# EAGLE design NixieClock (EAGLE 7.2.0)
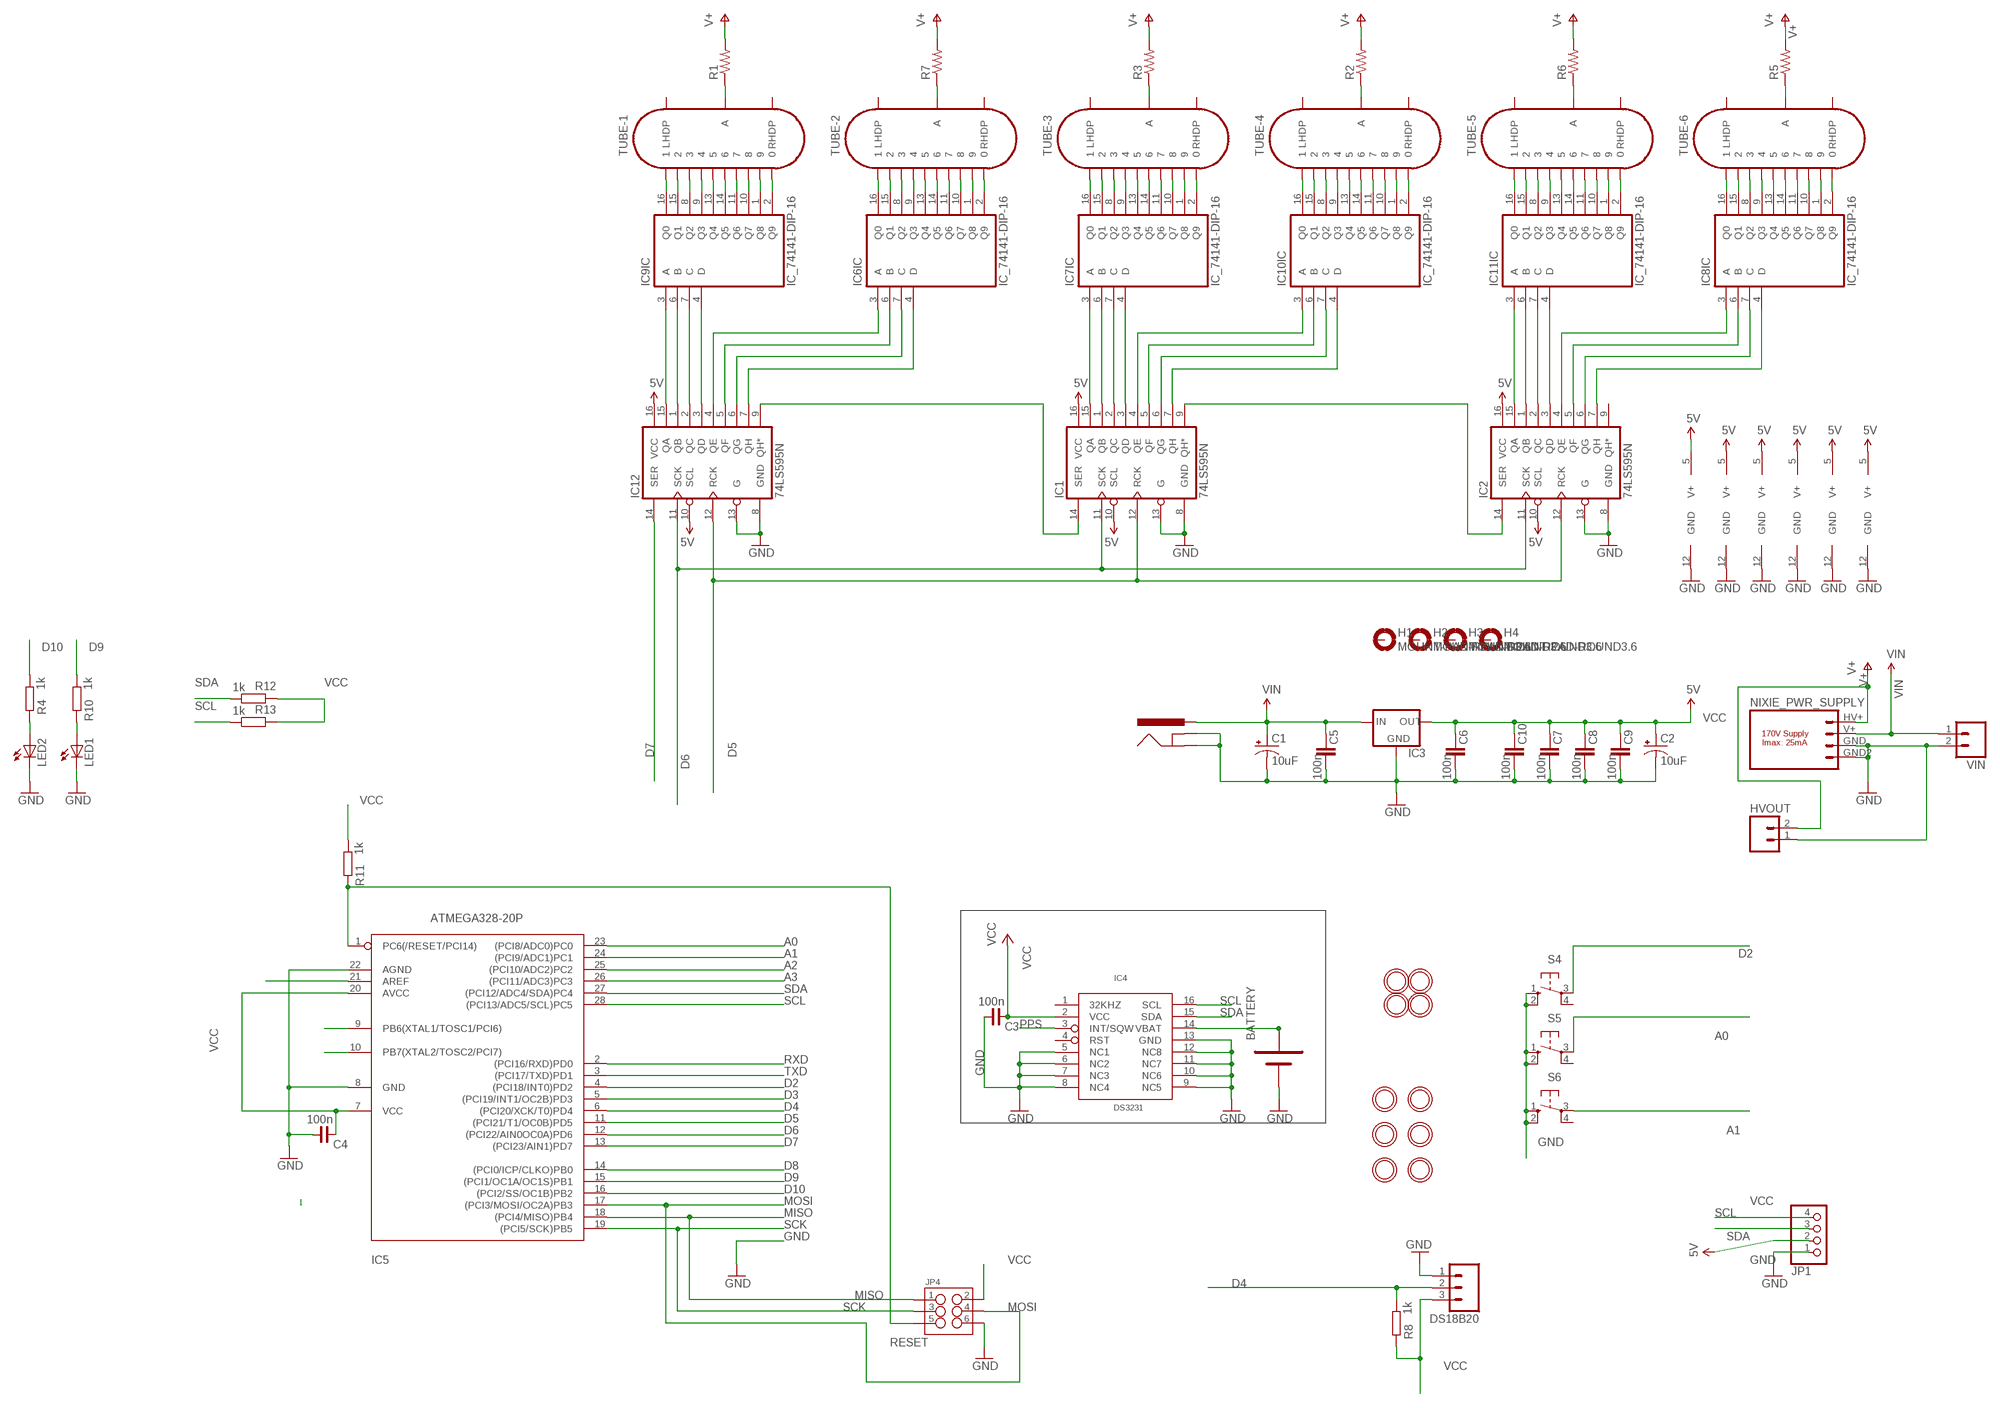
[diagram p0: schematic, sheet 1]

## Parts
BATTERY  BATTERY-1XAA20MM  [BATTCOM_20MM_PTH]
C1  10uF  CAP_POLPTH2  [CPOL-RADIAL-10UF-25V]
C2  10uF  CAP_POLPTH2  [CPOL-RADIAL-10UF-25V]
C3  100n  C_0603  [C0603]
C4  100n  C_0603  [C0603]
C5  100n  C-EU050-025X075  [C050-025X075]
C6  100n  C-EU050-025X075  [C050-025X075]
C7  100n  C-EU050-025X075  [C050-025X075]
C8  100n  C-EU050-025X075  [C050-025X075]
C9  100n  C-EU050-025X075  [C050-025X075]
C10  100n  C-EU050-025X075  [C050-025X075]
DS18B20  DS18B20DS18B20  [DS18B20]
H1  MOUNT-PAD-ROUND3.6  [3,6-PAD]
H2  MOUNT-PAD-ROUND3.6  [3,6-PAD]
H3  MOUNT-PAD-ROUND3.6  [3,6-PAD]
H4  MOUNT-PAD-ROUND3.6  [3,6-PAD]
HVOUT  M02PTH  [1X02]
IC1  74LS595N  [DIL16]
IC2  74LS595N  [DIL16]
IC3  V_REG_78XXSIDE  [78XXL]
IC4  DS3231  [SO16W]
IC5  ATMEGA328-20P  ATMEGA168-20P  [DIL28-3]
IC6  IC_74141-DIP-16  [DIL16]
IC7  IC_74141-DIP-16  [DIL16]
IC8  IC_74141-DIP-16  [DIL16]
IC9  IC_74141-DIP-16  [DIL16]
IC10  IC_74141-DIP-16  [DIL16]
IC11  IC_74141-DIP-16  [DIL16]
IC12  74LS595N  [DIL16]
J1  POWER_JACKPTH  [POWER_JACK_PTH]
JP1  PINHD-1X4  [1X04]
JP4  M03X2NO_SILK  [2X3-NS]
LED1  LED3MM  [LED3MM]
LED2  LED3MM  [LED3MM]
NIXIE_PWR_SUPPLY  NIXIE_PWR_SUPPLYPTH  [NIXIE_PWR_SUPPLY]
R1  RESISTORPTH-1/4W  [AXIAL-0.4]
R2  RESISTORPTH-1/4W  [AXIAL-0.4]
R3  RESISTORPTH-1/4W  [AXIAL-0.4]
R4  1k  R-EU_0204/5  [0204/5]
R5  RESISTORPTH-1/4W  [AXIAL-0.4]
R6  RESISTORPTH-1/4W  [AXIAL-0.4]
R7  RESISTORPTH-1/4W  [AXIAL-0.4]
R8  1k  R-EU_0204/5  [0204/5]
R10  1k  R-EU_0204/5  [0204/5]
R11  1k  R-EU_0204/5  [0204/5]
R12  1k  R-EU_0204/5  [0204/5]
R13  1k  R-EU_0204/5  [0204/5]
S4  10-XX  [B3F-10XX]
S5  10-XX  [B3F-10XX]
S6  10-XX  [B3F-10XX]
TUBE-1  IN-14  [IN-14]
TUBE-2  IN-14  [IN-14]
TUBE-3  IN-14  [IN-14]
TUBE-4  IN-14  [IN-14]
TUBE-5  IN-14  [IN-14]
TUBE-6  IN-14  [IN-14]
U$10  MOUNTINGHOLE3.0THIN  [MOUNTINGHOLE_3.0_PLATEDTHIN]
U$11  MOUNTINGHOLE3.0THIN  [MOUNTINGHOLE_3.0_PLATEDTHIN]
U$16  MOUNTINGHOLE3.0THIN  [MOUNTINGHOLE_3.0_PLATEDTHIN]
U$17  MOUNTINGHOLE3.0THIN  [MOUNTINGHOLE_3.0_PLATEDTHIN]
U$18  MOUNTINGHOLE3.0THIN  [MOUNTINGHOLE_3.0_PLATEDTHIN]
U$19  MOUNTINGHOLE3.0THIN  [MOUNTINGHOLE_3.0_PLATEDTHIN]
U$21  MOUNTINGHOLE3.0THIN  [MOUNTINGHOLE_3.0_PLATEDTHIN]
U$22  MOUNTINGHOLE3.0THIN  [MOUNTINGHOLE_3.0_PLATEDTHIN]
U$23  MOUNTINGHOLE3.0THIN  [MOUNTINGHOLE_3.0_PLATEDTHIN]
U$24  MOUNTINGHOLE3.0THIN  [MOUNTINGHOLE_3.0_PLATEDTHIN]
VIN  M02PTH  [1X02]

## Nets
A0: IC5.23((PCI8/ADC0)PC0) S5.3(P)
A1: IC5.24((PCI9/ADC1)PC1) S6.3(P)
A2: IC5.25((PCI10/ADC2)PC2)
A3: IC5.26((PCI11/ADC3)PC3)
AREF_RAW: IC5.21(AREF)
D2: IC5.4((PCI18/INT0)PD2) S4.3(P)
D3: IC5.5((PCI19/INT1/OC2B)PD3)
D4: DS18B20.2(DS) IC5.6((PCI20/XCK/T0)PD4) R8.1
D5: IC1.12(RCK) IC2.12(RCK) IC5.11((PCI21/T1/OC0B)PD5) IC12.12(RCK)
D6: IC1.11(SCK) IC2.11(SCK) IC5.12((PCI22/AIN0OC0A)PD6) IC12.11(SCK)
D7: IC5.13((PCI23/AIN1)PD7) IC12.14(SER)
D8: IC5.14((PCI0/ICP/CLKO)PB0)
D9: IC5.15((PCI1/OC1A/OC1S)PB1) R10.1
D10: IC5.16((PCI2/SS/OC1B)PB2) R4.1
GND: BATTERY.- C1.2(-) C2.2(-) C3.1 C4.1 C5.2 C6.2 C7.2 C8.2 C9.2 C10.2 DS18B20.1(GND) HVOUT.1 IC1.8(GND) IC1.13(G) IC2.8(GND) IC2.13(G) IC3.GND IC4.5(NC1) IC4.6(NC2) IC4.7(NC3) IC4.8(NC4) IC4.9(NC5) IC4.10(NC6) IC4.11(NC7) IC4.12(NC8) IC4.13(GND) IC5.8(GND) IC5.22(AGND) IC6.12(SUPPLY:GND) IC7.12(SUPPLY:GND) IC8.12(SUPPLY:GND) IC9.12(SUPPLY:GND) IC10.12(SUPPLY:GND) IC11.12(SUPPLY:GND) IC12.8(GND) IC12.13(G) J1.GND J1.GNDBREAK JP1.1 JP4.6 LED1.K(C) LED2.K(C) NIXIE_PWR_SUPPLY.GND NIXIE_PWR_SUPPLY.GND2 S4.1(S) S4.2(S1) S5.1(S) S5.2(S1) S6.1(S) S6.2(S1) VIN.2
MISO: IC5.18((PCI4/MISO)PB4) JP4.1
MOSI: IC5.17((PCI3/MOSI/OC2A)PB3) JP4.4
N$1 [High Voltage 170V]: R1.P$1 TUBE-1.A
N$2 [High Voltage 170V]: R7.P$1 TUBE-2.A
N$3 [High Voltage 170V]: R3.P$1 TUBE-3.A
N$4 [High Voltage 170V]: R2.P$1 TUBE-4.A
N$5 [High Voltage 170V]: R6.P$1 TUBE-5.A
N$6 [High Voltage 170V]: R5.P$1 TUBE-6.A
N$7: IC9.16(IC:Q0) TUBE-1.1
N$8 [High Voltage 60V]: IC9.15(IC:Q1) TUBE-1.2
N$9 [High Voltage 60V]: IC9.8(IC:Q2) TUBE-1.3
N$10 [High Voltage 60V]: IC9.9(IC:Q3) TUBE-1.4
N$11 [High Voltage 60V]: IC9.13(IC:Q4) TUBE-1.5
N$12 [High Voltage 60V]: IC9.14(IC:Q5) TUBE-1.6
N$13 [High Voltage 60V]: IC9.11(IC:Q6) TUBE-1.7
N$14 [High Voltage 60V]: IC9.10(IC:Q7) TUBE-1.8
N$15 [High Voltage 60V]: IC9.1(IC:Q8) TUBE-1.9
N$16 [High Voltage 60V]: IC9.2(IC:Q9) TUBE-1.0
N$17 [High Voltage 60V]: IC6.16(IC:Q0) TUBE-2.1
N$18 [High Voltage 60V]: IC6.15(IC:Q1) TUBE-2.2
N$19 [High Voltage 60V]: IC6.8(IC:Q2) TUBE-2.3
N$20 [High Voltage 60V]: IC6.9(IC:Q3) TUBE-2.4
N$21 [High Voltage 60V]: IC6.13(IC:Q4) TUBE-2.5
N$22 [High Voltage 60V]: IC6.14(IC:Q5) TUBE-2.6
N$23 [High Voltage 60V]: IC6.11(IC:Q6) TUBE-2.7
N$24 [High Voltage 60V]: IC6.10(IC:Q7) TUBE-2.8
N$25 [High Voltage 60V]: IC6.1(IC:Q8) TUBE-2.9
N$26 [High Voltage 60V]: IC6.2(IC:Q9) TUBE-2.0
N$27 [High Voltage 60V]: IC7.16(IC:Q0) TUBE-3.1
N$28 [High Voltage 60V]: IC7.15(IC:Q1) TUBE-3.2
N$29 [High Voltage 60V]: IC7.8(IC:Q2) TUBE-3.3
N$30 [High Voltage 60V]: IC7.9(IC:Q3) TUBE-3.4
N$31 [High Voltage 60V]: IC7.13(IC:Q4) TUBE-3.5
N$32 [High Voltage 60V]: IC7.14(IC:Q5) TUBE-3.6
N$33 [High Voltage 60V]: IC7.11(IC:Q6) TUBE-3.7
N$34 [High Voltage 60V]: IC7.10(IC:Q7) TUBE-3.8
N$35 [High Voltage 60V]: IC7.1(IC:Q8) TUBE-3.9
N$36 [High Voltage 60V]: IC7.2(IC:Q9) TUBE-3.0
N$37 [High Voltage 60V]: IC10.16(IC:Q0) TUBE-4.1
N$38 [High Voltage 60V]: IC10.15(IC:Q1) TUBE-4.2
N$39 [High Voltage 60V]: IC10.8(IC:Q2) TUBE-4.3
N$40 [High Voltage 60V]: IC10.9(IC:Q3) TUBE-4.4
N$41 [High Voltage 60V]: IC10.13(IC:Q4) TUBE-4.5
N$42 [High Voltage 60V]: IC10.14(IC:Q5) TUBE-4.6
N$43 [High Voltage 60V]: IC10.11(IC:Q6) TUBE-4.7
N$44 [High Voltage 60V]: IC10.10(IC:Q7) TUBE-4.8
N$45 [High Voltage 60V]: IC10.1(IC:Q8) TUBE-4.9
N$46 [High Voltage 60V]: IC10.2(IC:Q9) TUBE-4.0
N$47 [High Voltage 60V]: IC11.16(IC:Q0) TUBE-5.1
N$48 [High Voltage 60V]: IC11.15(IC:Q1) TUBE-5.2
N$49 [High Voltage 60V]: IC11.8(IC:Q2) TUBE-5.3
N$50 [High Voltage 60V]: IC11.9(IC:Q3) TUBE-5.4
N$51 [High Voltage 60V]: IC11.13(IC:Q4) TUBE-5.5
N$52 [High Voltage 60V]: IC11.14(IC:Q5) TUBE-5.6
N$53 [High Voltage 60V]: IC11.11(IC:Q6) TUBE-5.7
N$54 [High Voltage 60V]: IC11.10(IC:Q7) TUBE-5.8
N$55 [High Voltage 60V]: IC11.1(IC:Q8) TUBE-5.9
N$56 [High Voltage 60V]: IC11.2(IC:Q9) TUBE-5.0
N$57 [High Voltage 60V]: IC8.16(IC:Q0) TUBE-6.1
N$58 [High Voltage 60V]: IC8.15(IC:Q1) TUBE-6.2
N$59 [High Voltage 60V]: IC8.8(IC:Q2) TUBE-6.3
N$60 [High Voltage 60V]: IC8.9(IC:Q3) TUBE-6.4
N$61 [High Voltage 60V]: IC8.13(IC:Q4) TUBE-6.5
N$62 [High Voltage 60V]: IC8.14(IC:Q5) TUBE-6.6
N$63 [High Voltage 60V]: IC8.11(IC:Q6) TUBE-6.7
N$64 [High Voltage 60V]: IC8.10(IC:Q7) TUBE-6.8
N$65 [High Voltage 60V]: IC8.1(IC:Q8) TUBE-6.9
N$66 [High Voltage 60V]: IC8.2(IC:Q9) TUBE-6.0
N$67: IC1.1(QB) IC7.6(IC:B)
N$68: IC1.2(QC) IC7.7(IC:C)
N$69: IC1.3(QD) IC7.4(IC:D)
N$70: IC1.15(QA) IC7.3(IC:A)
N$71: IC9.6(IC:B) IC12.1(QB)
N$72: IC9.7(IC:C) IC12.2(QC)
N$73: IC9.4(IC:D) IC12.3(QD)
N$74: IC9.3(IC:A) IC12.15(QA)
N$75: IC2.1(QB) IC11.6(IC:B)
N$76: IC2.2(QC) IC11.7(IC:C)
N$77: IC2.3(QD) IC11.4(IC:D)
N$78: IC2.15(QA) IC11.3(IC:A)
N$79: IC6.3(IC:A) IC12.4(QE)
N$80: IC6.6(IC:B) IC12.5(QF)
N$81: IC6.7(IC:C) IC12.6(QG)
N$82: IC6.4(IC:D) IC12.7(QH)
N$83: IC1.14(SER) IC12.9(QH*)
N$84: IC1.9(QH*) IC2.14(SER)
N$85: IC1.4(QE) IC10.3(IC:A)
N$86: IC1.5(QF) IC10.6(IC:B)
N$87: IC1.6(QG) IC10.7(IC:C)
N$88: IC1.7(QH) IC10.4(IC:D)
N$89: LED2.A R4.2
N$90: IC2.4(QE) IC8.3(IC:A)
N$91: IC2.5(QF) IC8.6(IC:B)
N$92: IC2.6(QG) IC8.7(IC:C)
N$93: IC2.7(QH) IC8.4(IC:D)
N$102: BATTERY.+ IC4.14(VBAT)
N$103: LED1.A R10.2
N$104: IC5.9(PB6(XTAL1/TOSC1/PCI6))
N$105: IC5.10(PB7(XTAL2/TOSC2/PCI7))
PPS: IC4.3(INT/SQW)
RESET: IC5.1(PC6(/RESET/PCI14)) JP4.5 R11.2
RXD: IC5.2((PCI16/RXD)PD0)
SCK: IC5.19((PCI5/SCK)PB5) JP4.3
SCL: IC4.16(SCL) IC5.28((PCI13/ADC5/SCL)PC5) JP1.4 R13.1
SDA: IC4.15(SDA) IC5.27((PCI12/ADC4/SDA)PC4) JP1.3 R12.1
TXD: IC5.3((PCI17/TXD)PD1)
V+ [High Voltage 170V]: HVOUT.2 NIXIE_PWR_SUPPLY.HV+ R1.P$2 R2.P$2 R3.P$2 R5.P$2 R6.P$2 R7.P$2
VCC [High Voltage 170V]: C2.1(+) C3.2 C4.2 C6.1 C7.1 C8.1 C9.1 C10.1 DS18B20.3(5V) IC1.10(SCL) IC1.16(VCC) IC2.10(SCL) IC2.16(VCC) IC3.OUT IC4.2(VCC) IC5.7(VCC) IC5.20(AVCC) IC6.5(SUPPLY:V+) IC7.5(SUPPLY:V+) IC8.5(SUPPLY:V+) IC9.5(SUPPLY:V+) IC10.5(SUPPLY:V+) IC11.5(SUPPLY:V+) IC12.10(SCL) IC12.16(VCC) JP1.2 JP4.2 R8.2 R11.1 R12.2 R13.2 ; supply symbol labelled 5V
VIN: C1.1(+) C5.1 IC3.IN J1.PWR NIXIE_PWR_SUPPLY.V+ VIN.1
Unconnected: H1.B3,6(MOUNT) H2.B3,6(MOUNT) H3.B3,6(MOUNT) H4.B3,6(MOUNT) IC2.9(QH*) IC4.1(32KHZ) IC4.4(RST) S4.4(P1) S5.4(P1) S6.4(P1) TUBE-1.LHDP TUBE-1.RHDP TUBE-2.LHDP TUBE-2.RHDP TUBE-3.LHDP TUBE-3.RHDP TUBE-4.LHDP TUBE-4.RHDP TUBE-5.LHDP TUBE-5.RHDP TUBE-6.LHDP TUBE-6.RHDP

## Library data of the parts
BATTERY = es:BATTERY-1XAA
C1 C2 = SparkFun-Passives:CAP_POL: Capacitor Polarized These are standard SMD and PTH capacitors. Normally 10uF, 47uF, and 100uF in electrolytic and tantalum varieties. Always verify the external diameter of the through hole cap, it varies with capacity, voltage, and manufacturer. The EIA devices should be standard.
C3 C4 = rc-master-smd:C_: NON-POLARIZED CAP
C5-C10 = rcl:C-EU: CAPACITOR, European symbol
DS18B20 = ScottCustom:DS18B20: Header 3 Standard 3-pin 0.1" header. Use with straight break away headers (SKU : PRT-00116), right angle break away headers (PRT-00553), swiss pins (PRT-00743), machine pins (PRT-00117), and female headers (PRT-00115). Molex polarized connector foot print use with SKU : PRT-08232 with associated crimp pins and housings.
H1-H4 = holes:MOUNT-PAD-ROUND: MOUNTING PAD, round
HVOUT VIN = SparkFun:M02: Header 2 Standard 2-pin 0.1" header. Use with straight break away headers (SKU : PRT-00116), right angle break away headers (PRT-00553), swiss pins (PRT-00743), machine pins (PRT-00117), and female headers (PRT-00115). Molex polarized connector foot print use with SKU : PRT-08233 with associated crimp pins and housings.
IC1 IC2 IC12 = SparkFun:74*595: 8-bit SHIFT REGISTER, output latch
IC3 = SparkFun:V_REG_78XX: Voltage Regulator Standard 7805 5V regulator. IGO (Input Ground Output). Spark Fun Electronics SKU : COM-00107
IC4 = JVN:DS3231
IC5 = avr:ATMEGA168*P: MICROCONTROLLER 16 kBytes FLASH 1 kBytes SRAM 512 Bytes EEPROM USART 8-channel 10 bit ADC
IC6-IC11 = dp_devices:IC_74141: BCD to decimal decoder
J1 = SparkFun:POWER_JACK: Power Jack This is the standard 5.5mm barrel jack for power. The PTH is the most common, proven, reliable, footprint. All others are experimental. The Slot footprint only works if the mill layer is transmitted to the PCB fab house so be warned. Spark Fun Electronics SKU : PRT-00119. Mating wall wart : TOL-00298 (and others)
JP1 = pinhead:PINHD-1X4: PIN HEADER
JP4 = SparkFun-Connectors:M03X2: 2x3 .1" header. Shrouded, with keying- CONN-10681 SMT- CONN-11415 Pogo pins- HW-11044
LED1 LED2 = led:LED: LED OSRAM: - CHIPLED LG R971, LG N971, LY N971, LG Q971, LY Q971, LO R971, LY R971 LH N974, LH R974 LS Q976, LO Q976, LY Q976 LO Q996 - Hyper CHIPLED LW Q18S LB Q993, LB Q99A, LB R99A - SideLED LS A670, LO A670, LY A670, LG A670, LP A670 LB A673, LV A673, LT A673, LW A673 LH A674 LY A675 LS A676, LA A676, LO A676, LY A676, LW A676 LS A679, LY A679, LG A679 - Hyper Micro SIDELED® LS Y876, LA Y876, LO Y876, LY Y876 LT Y87S - SmartLED LW L88C, LW L88S LB L89C, LB L89S, LG L890 LS L89K, LO L89K, LY L89K LS L896, LA L896, LO L896, LY L896 - TOPLED LS T670, LO T670, LY T670, LG T670, LP T670 LSG T670, LSP T670, LSY T670, LOP T670, LYG T670 LG T671, LOG T671, LSG T671 LB T673, LV T673, LT T673, LW T673 LH T674 LS T676, LA T676, LO T676, LY T676, LB T676, LH T676, LSB T676, LW T676 LB T67C, LV T67C, LT T67C, LS T67K, LO T67K, LY T67K, LW E67C LS E67B, LA E67B, LO E67B, LY E67B, LB E67C, LV E67C, LT E67C LW T67C LS T679, LY T679, LG T679 LS T770, LO T770, LY T770, LG T770, LP T770 LB T773, LV T773, LT T773, LW T773 LH T774 LS E675, LA E675, LY E675, LS T675 LS T776, LA T776, LO T776, LY T776, LB T776 LHGB T686 LT T68C, LB T68C - Hyper Mini TOPLED® LB M676 - Mini TOPLED Santana® LG M470 LS M47K, LO M47K, LY M47K Source: http://www.osram.convergy.de LUXEON: - LUMILED® LXK2-PW12-R00, LXK2-PW12-S00, LXK2-PW14-U00, LXK2-PW14-V00 LXK2-PM12-R00, LXK2-PM12-S00, LXK2-PM14-U00 LXK2-PE12-Q00, LXK2-PE12-R00, LXK2-PE12-S00, LXK2-PE14-T00, LXK2-PE14-U00 LXK2-PB12-K00, LXK2-PB12-L00, LXK2-PB12-M00, LXK2-PB14-N00, LXK2-PB14-P00, LXK2-PB14-Q00 LXK2-PR12-L00, LXK2-PR12-M00, LXK2-PR14-Q00, LXK2-PR14-R00 LXK2-PD12-Q00, LXK2-PD12-R00, LXK2-PD12-S00 LXK2-PH12-R00, LXK2-PH12-S00 LXK2-PL12-P00, LXK2-PL12-Q00, LXK2-PL12-R00 Source: www.luxeon.com KINGBRIGHT: KA-3528ASYC Source: www.kingbright.com
NIXIE_PWR_SUPPLY = ScottCustom:NIXIE_PWR_SUPPLY: Header 4 Standard 4-pin 0.1" header. Use with straight break away headers (SKU : PRT-00116), right angle break away headers (PRT-00553), swiss pins (PRT-00743), machine pins (PRT-00117), and female headers (PRT-00115). Molex polarized connector foot print use with SKU : PRT-08231 with associated crimp pins and housings. 1MM SMD Version SKU: PRT-10208
R1-R3 R5-R7 = SparkFun:RESISTOR: Resistor Basic schematic elements and footprints for 0603, 1206, and PTH resistors.
R4 R8 R10-R13 = rcl:R-EU_: RESISTOR, European symbol
S4-S6 = switch-omron:10-XX: OMRON SWITCH; MPN: B3F-1000; OC_FARNELL: 176432; OC_NEWARK: 36M3542
TUBE-1-TUBE-6 = ScottCustom:IN-14: IN-14: medium numeric frontview nixie tube
U$10 U$11 U$16-U$19 U$21-U$24 = microbuilder:MOUNTINGHOLE: Mounting Hole

## Net classes
0 default: width 0.305 mm, clearance 0.305 mm
1 High Voltage 170V: width 0.61 mm, clearance 0.61 mm
2 High Voltage 60V: width 0.406 mm, clearance 0.406 mm
3 Power GND: width 1.016 mm, clearance 0.406 mm

## Board
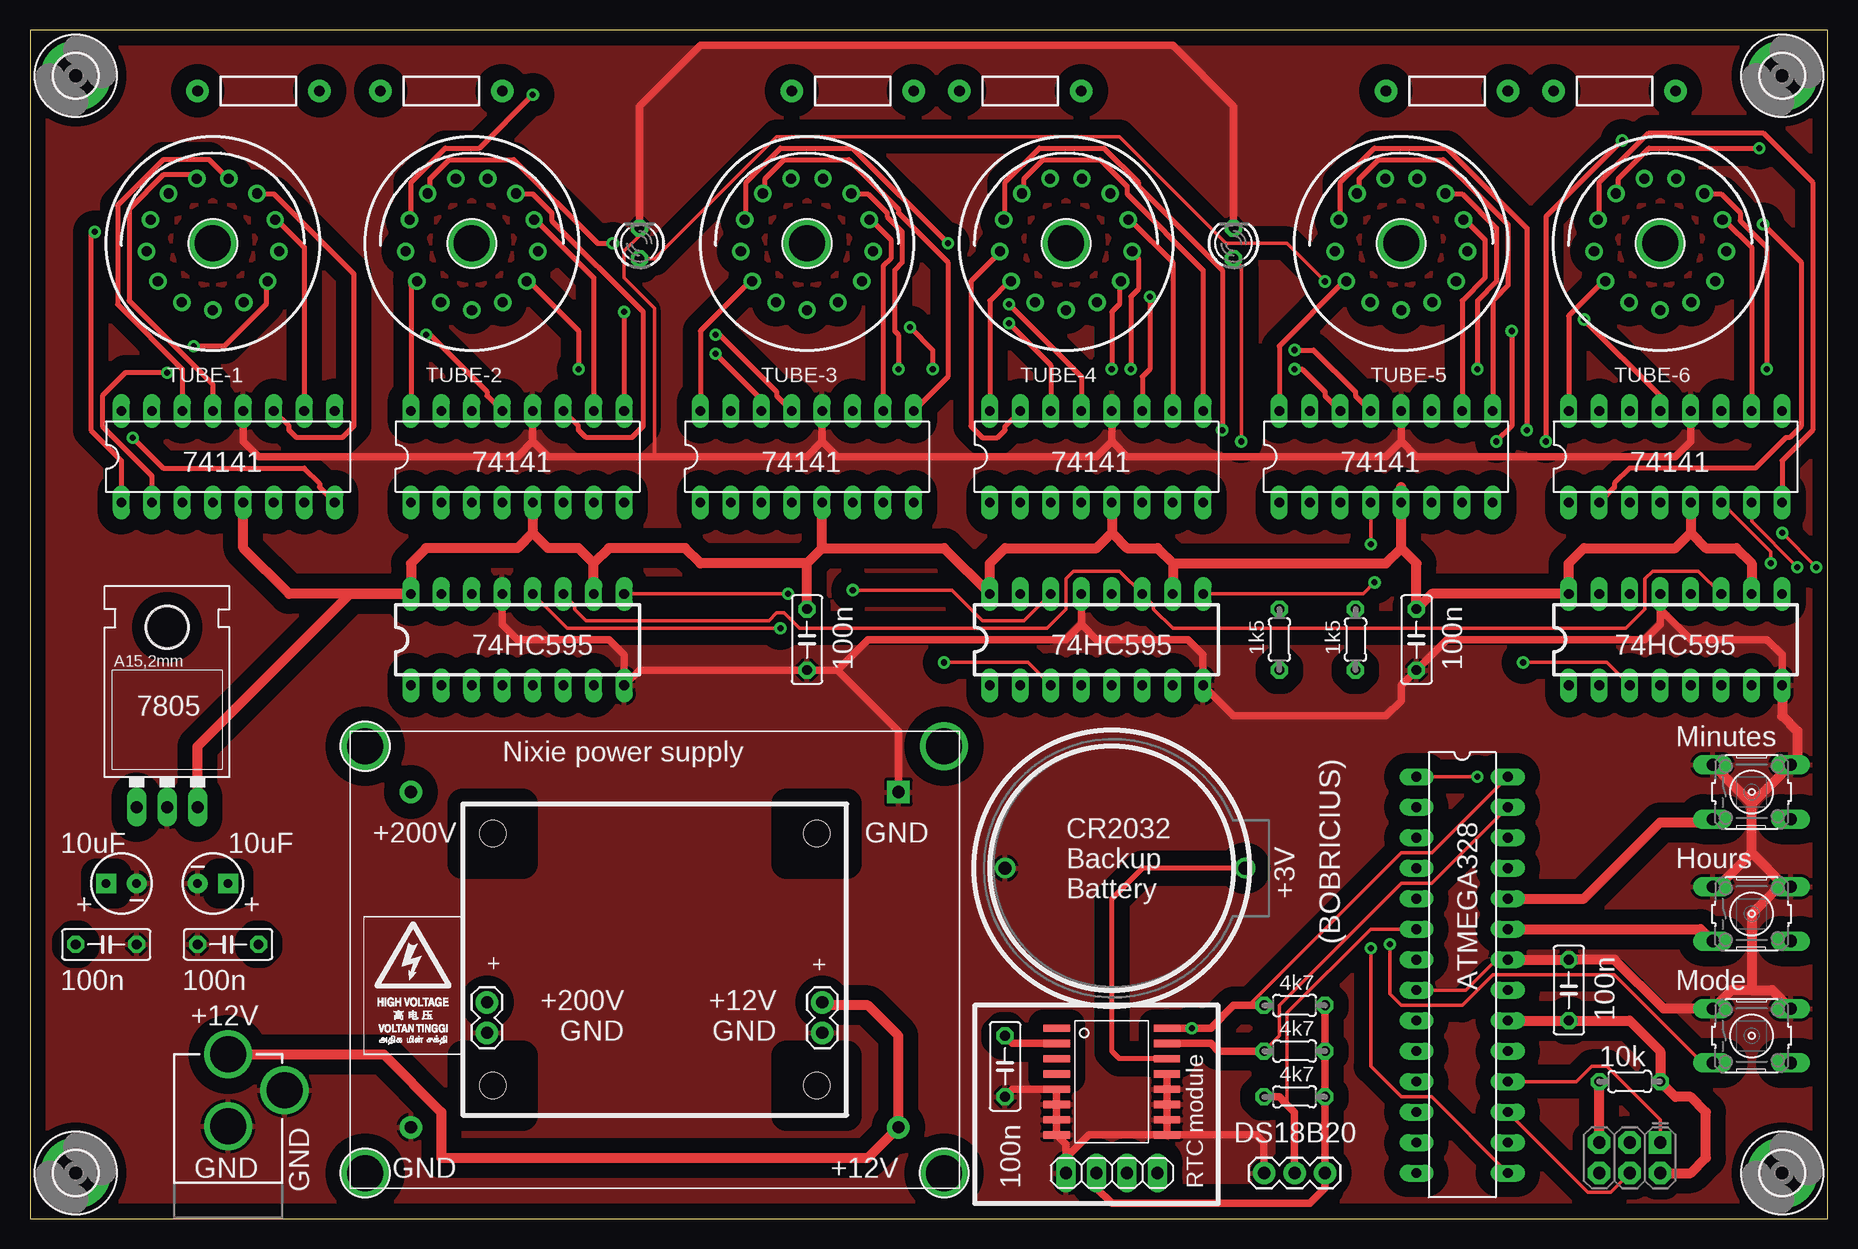
[diagram p1: board, top side]
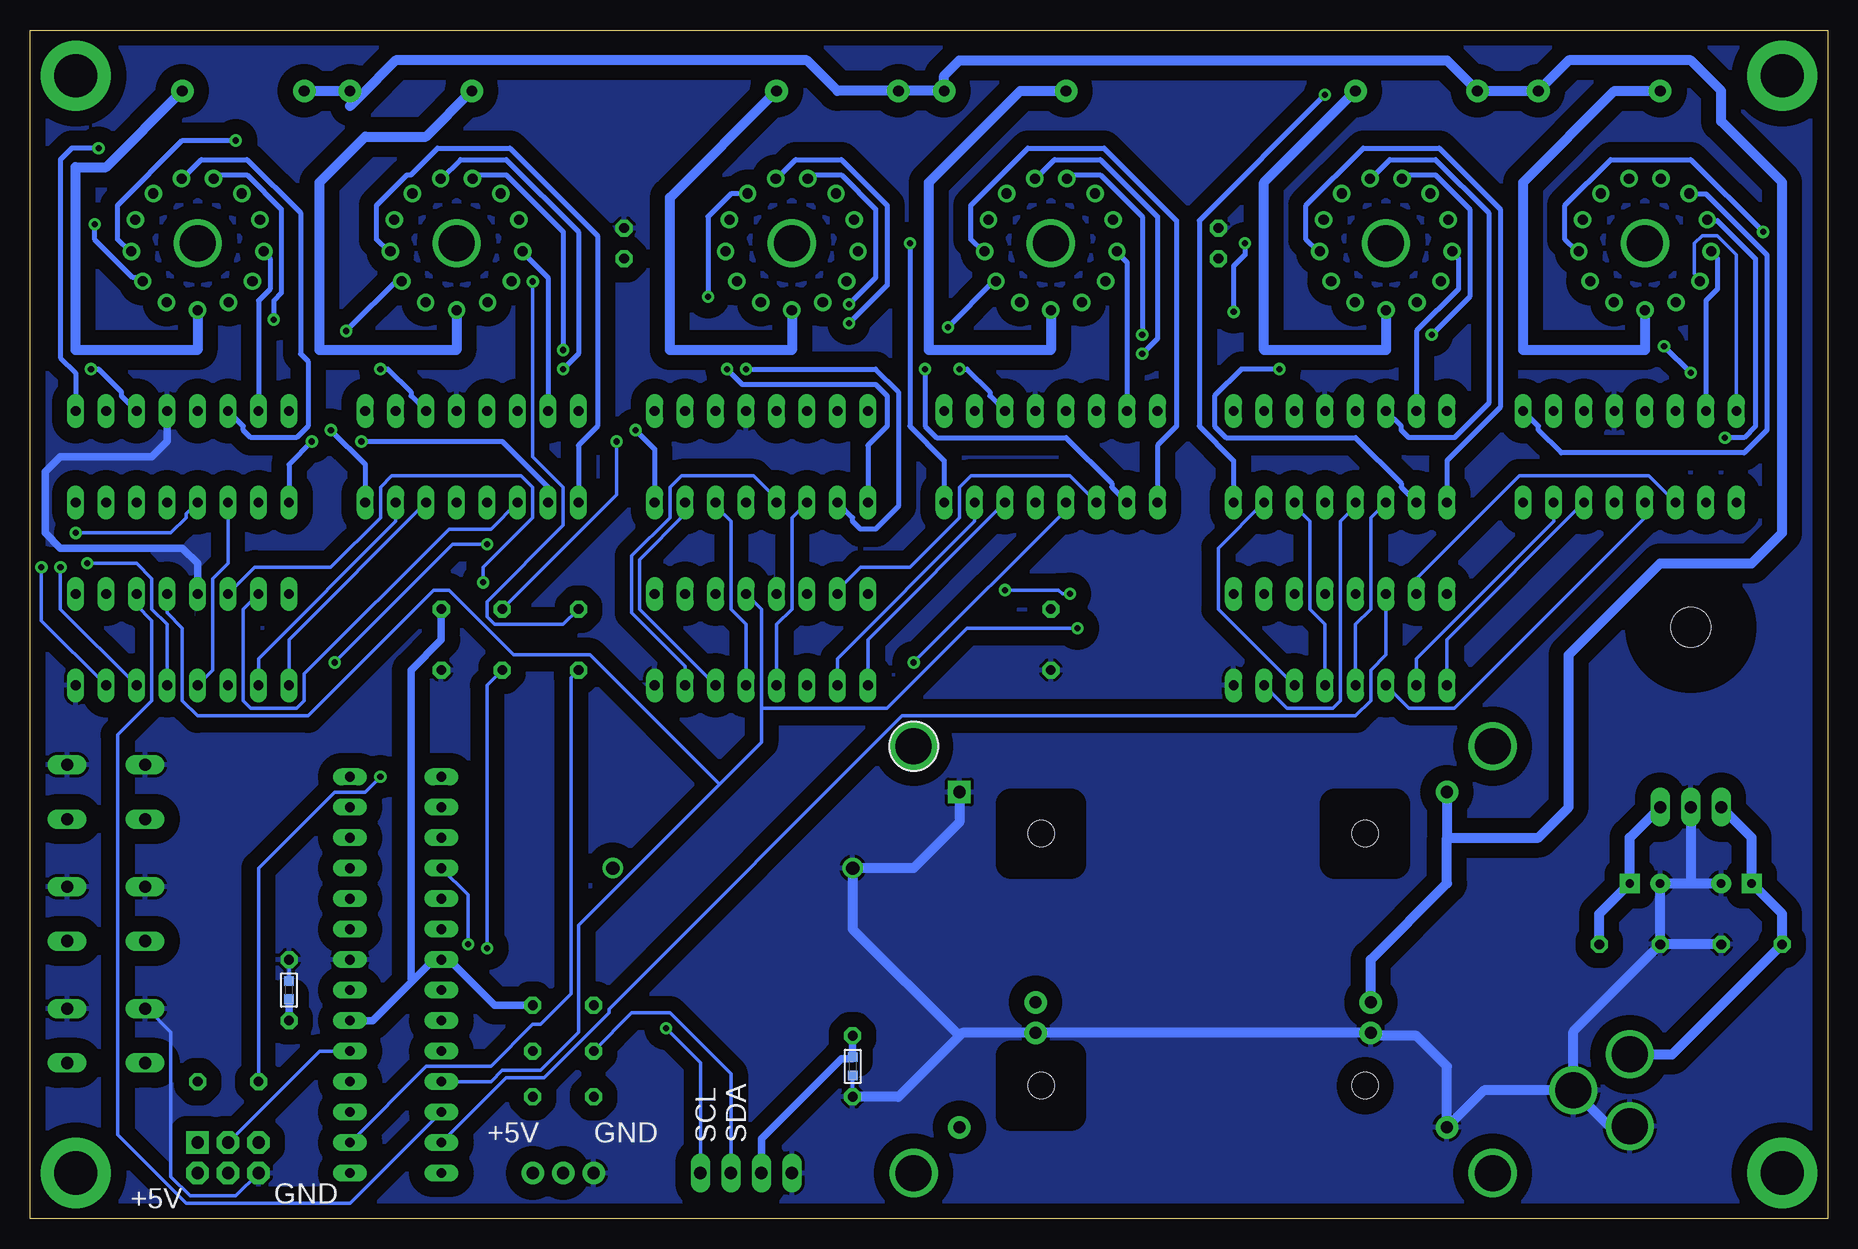
[diagram p2: board, bottom side, seen from below]

Size 149.86 x 99.06 mm. Coordinates in mm from the lower left corner, seen from the top.
Outline: 0,0 149.84,0 149.86,99.06 0,99.06 0,0
Copper layers (1*16): Top 0.035mm / dielectric 1.5mm / Bottom 0.035mm
Design rules "SparkFun": minimum track width 8mil, minimum drill 20mil, track to track 8mil, track to pad 8mil, pad to pad 8mil, via to via 8mil, smd to smd 8mil, copper to edge 10mil, drill to drill 8mil, minimum pad ring 12mil, minimum via ring 10mil, stop-mask expansion 4mil, vias tented up to drill 25mil, thermal gap 10mil
Holes 2.2 mm at 65.57,32.09 38.57,32.09 38.57,11.09 65.57,11.09
tRestrict: area 63.1,29.6 to 68.1,34.6; area 36.1,29.6 to 41.1,34.6; area 36.1,8.6 to 41.1,13.6; area 63.1,8.6 to 68.1,13.6
bRestrict: area 63.1,8.6 to 68.1,13.6; area 63.1,29.6 to 68.1,34.6; area 36.1,29.6 to 41.1,34.6

### Footprints (pad centres in the part's own frame; a part is rotated, then mirrored left to right if it is on the bottom)
BATTCOM_20MM_PTH = drill 1.1: + 20,0; - 0,0
CPOL-RADIAL-10UF-25V = drill 0.7 pad 1.651 square: 1 1.27,0 | drill 0.7 pad 1.651: 2 -1.27,0
C0603 = smd 0.8 x 0.8: 1 -0.762,0; 2 0.762,0
C050-025X075 = drill 0.813 octagon: 1 -2.54,0; 2 2.54,0
DS18B20 = drill 1.016 pad 1.88: 1 0,0; 2 2.54,0; 3 5.08,0
3,6-PAD = drill 3.6 pad 5.842: B3,6 0,0
1X02 = drill 1.016 pad 1.88: 1 0,0; 2 2.54,0
DIL16 = drill 0.813 long: 1 -8.89,-3.81; 2 -6.35,-3.81; 3 -3.81,-3.81; 4 -1.27,-3.81; 5 1.27,-3.81; 6 3.81,-3.81; 7 6.35,-3.81; 8 8.89,-3.81; 9 8.89,3.81; 10 6.35,3.81; 11 3.81,3.81; 12 1.27,3.81; 13 -1.27,3.81; 14 -3.81,3.81; 15 -6.35,3.81; 16 -8.89,3.81
78XXL = drill 1.016 long: GND 0,-3.81; IN -2.54,-3.81; OUT 2.54,-3.81 | hole 3.302: 0,11.176
SO16W = smd 0.6 x 2.2: 1 -4.445,-4.6; 2 -3.175,-4.6; 3 -1.905,-4.6; 4 -0.635,-4.6; 5 0.635,-4.6; 6 1.905,-4.6; 7 3.175,-4.6; 8 4.445,-4.6; 9 4.445,4.6; 10 3.175,4.6; 11 1.905,4.6; 12 0.635,4.6; 13 -0.635,4.6; 14 -1.905,4.6; 15 -3.175,4.6; 16 -4.445,4.6
DIL28-3 = drill 0.813 long: 1 -16.51,-3.81; 2 -13.97,-3.81; 3 -11.43,-3.81; 4 -8.89,-3.81; 5 -6.35,-3.81; 6 -3.81,-3.81; 7 -1.27,-3.81; 8 1.27,-3.81; 9 3.81,-3.81; 10 6.35,-3.81; 11 8.89,-3.81; 12 11.43,-3.81; 13 13.97,-3.81; 14 16.51,-3.81; 15 16.51,3.81; 16 13.97,3.81; 17 11.43,3.81; 18 8.89,3.81; 19 6.35,3.81; 20 3.81,3.81; 21 1.27,3.81; 22 -1.27,3.81; 23 -3.81,3.81; 24 -6.35,3.81; 25 -8.89,3.81; 26 -11.43,3.81; 27 -13.97,3.81; 28 -16.51,3.81
POWER_JACK_PTH = drill 2.997: GND 0,7.7; GNDBREAK 4.7,10.7; PWR 0,13.7
1X04 = drill 1.016 long: 1 -3.81,0; 2 -1.27,0; 3 1.27,0; 4 3.81,0
2X3-NS = drill 1.016 pad 1.88 square: 1 -2.54,-1.27 | drill 1.016 pad 1.88 octagon: 2 -2.54,1.27; 3 0,-1.27; 4 0,1.27; 5 2.54,-1.27; 6 2.54,1.27
LED3MM = drill 0.813 octagon: A -1.27,0; K 1.27,0
NIXIE_PWR_SUPPLY = drill 1.016 pad 1.88: GND 21.59,17.78; HV+ 21.59,-10.16; V+ -19.05,17.78 | drill 1.016 pad 1.88 square: GND2 -19.05,-10.16
AXIAL-0.4 = drill 0.9 pad 1.88: P$1 -5.08,0; P$2 5.08,0
0204/5 = drill 0.813 octagon: 1 -2.54,0; 2 2.54,0
B3F-10XX = drill 1.016 long: 1 -3.251,2.261; 2 3.251,2.261; 3 -3.251,-2.261; 4 3.251,-2.261
IN-14 = drill 0.84: 0 4.572,-3.157; 1 -4.572,-3.157; 2 -5.517,-0.671; 3 -5.194,1.971; 4 -3.686,4.158; 5 -1.331,5.395; 6 1.331,5.395; 7 3.686,4.158; 8 5.194,1.971; 9 5.517,-0.671; A 0,-5.558; LHDP 2.583,-4.92; RHDP -2.583,-4.92
MOUNTINGHOLE_3.0_PLATEDTHIN = drill 3 pad 3.6: P$1 0,0

### Placement (x,y rotation side)
BATTERY  81.28,29.21 0 top
C1  7.62,27.94 180 top
C2  15.24,27.94 0 top
C3  81.28,12.7 90 bottom
C4  128.27,19.05 270 bottom
C5  6.35,22.86 0 top
C6  16.51,22.86 180 top
C7  81.28,12.7 270 top
C8  64.77,48.26 270 top
C9  128.27,19.05 90 top
C10  115.57,48.26 270 top
DS18B20  102.87,3.81 0 top
H1  3.81,3.81 0 top
H2  146.05,3.81 0 top
H3  146.05,95.25 0 top
H4  3.81,95.25 0 top
HVOUT  38.1,15.49 90 top
IC1  88.9,48.26 0 top
IC2  137.16,48.26 0 top
IC3  11.43,38.1 0 top
IC4  90.17,11.43 270 top
IC5  119.38,20.32 270 top
IC6  40.64,63.5 0 top
IC7  64.77,63.5 0 top
IC8  137.16,63.5 0 top
IC9  16.51,63.5 0 top
IC10  88.9,63.5 0 top
IC11  113.03,63.5 0 top
IC12  40.64,48.26 0 top
J1  16.51,0 0 top
JP1  90.17,3.81 0 top
JP4  133.35,5.08 180 top
LED1  100.33,81.28 90 top
LED2  50.8,81.28 90 top
NIXIE_PWR_SUPPLY  53.34,25.4 180 top
R1  19.05,93.98 0 top
R2  82.55,93.98 180 top
R3  68.58,93.98 0 top
R4  104.14,48.26 90 top
R5  132.08,93.98 180 top
R6  118.11,93.98 0 top
R7  34.29,93.98 180 top
R8  105.41,10.16 0 top
R10  110.49,48.26 90 top
R11  133.35,11.43 180 top
R12  105.41,13.97 0 top
R13  105.41,17.78 0 top
S4  143.51,15.24 0 top
S5  143.51,25.4 0 top
S6  143.51,35.56 0 top
TUBE-1  15.24,81.28 0 top
TUBE-2  36.83,81.28 0 top
TUBE-3  64.77,81.28 0 top
TUBE-4  86.36,81.28 0 top
TUBE-5  114.3,81.28 0 top
TUBE-6  135.89,81.28 0 top
U$10  135.89,81.28 0 top
U$11  114.3,81.28 0 top
U$16  86.36,81.28 0 top
U$17  64.77,81.28 0 top
U$18  36.83,81.28 0 top
U$19  15.24,81.28 0 top
U$20  [HV03]  27.79,13.65 0 top
U$21  27.94,39.37 0 top
U$22  76.2,3.81 90 top
U$23  76.2,39.37 90 bottom
U$24  27.94,3.81 90 top
VIN  66.04,18.03 270 top

### Tracks (layer width: path | path; a pad name or v marks a point on that pad's centre or on a via)
A0
  Top 0.813: IC5.23 139.27,24.13 S5.3
A1
  Top 0.813: IC5.24 129.54,26.67 135.89,33.02 139.98,33.02 S6.3
D2  (via drill 0.51)
  Top 0.305: v113.35,22.86 113.35,18.73 114.3,17.78 119.38,17.78 121.92,20.32 132.08,20.32 139.38,13.02 140.02,13.02 S4.3
  Bottom 0.305: IC5.4 113.35,26.99 v113.35,22.86
D4
  Top 0.305: IC5.6 111.76,24.13 104.78,17.14 104.78,9.84 104.62,9.68
  Top 0.61: R8.1 104.14,10.16 104.62,9.68 105.41,8.89 DS18B20.2
D5  (via drill 0.51)
  Top 0.305: IC12.12 44.77,49.21 v62.55,49.21
  Bottom 0.305: IC5.11 111.44,11.43 110.49,12.38 107.31,12.38 104.14,15.56 104.14,24.45 92.39,36.2 | 92.39,36.2 88.9,39.69 88.9,42.55 | 88.9,42.55 88.9,50.8 IC1.12 | v62.55,49.21 71.75,49.21 78.42,42.55 88.9,42.55 | IC2.12 138.43,50.48 137.16,49.21 137.16,43.18 135.89,41.91 126.68,41.91 116.21,52.39 114.94,52.39 109.54,46.99 103.19,46.99 92.39,36.2
D6
  Top 0.305: IC12.11 45.4,51.12 45.4,50.8 46.36,49.85 61.59,49.85 62.23,50.48 62.86,50.48 64.14,49.21 84.77,49.21 86.36,50.8 86.36,53.34 87,53.98 90.81,53.98 IC1.11 93.66,51.12 93.66,50.8 95.25,49.21 133.03,49.21 134.62,50.8 134.62,53.34 135.25,53.98 139.06,53.98 IC2.11
  Bottom 0.305: IC5.12 123.19,1.27 136.84,1.27 142.56,6.99 142.56,40.32 139.7,43.18 139.7,49.85 140.97,51.12 IC2.11
D7
  Bottom 0.305: IC12.14 36.83,46.99 38.1,45.72 38.1,43.18 39.37,41.91 77.15,41.91 101.6,17.46 101.6,17.14 107,11.75 110.17,11.75 IC5.13
D9  (via drill 0.51)
  Top 0.305: IC5.15 116.84,10.16 114.3,10.16 111.76,12.7 v111.76,22.54
  Bottom 0.305: v111.76,22.54 111.76,44.45 R10.1
D10
  Bottom 0.305: IC5.16 116.84,12.7 111.44,12.7 107.95,16.19 107.31,16.19 104.78,18.73 104.78,45.09 R4.1
GND
  Top 0.305: IC5.8 119.7,19.05 122.24,21.59 IC5.22 | LED2.K 50.8,81.92 49.53,80.64 49.53,78.42 52.07,75.88 52.07,63.5
  Top 0.61: 67.31,45.72 C8.2 50.8,45.72 IC12.8 49.53,46.99 48.26,48.26 40.64,48.26 39.37,49.53 IC12.13 | 67.31,45.72 72.39,40.64 NIXIE_PWR_SUPPLY.GND2 | IC2.8 146.05,46.99 144.78,48.26 138.43,48.26 135.89,50.8 IC2.13 135.89,49.53 134.62,48.26 118.11,48.26 C10.2 114.3,44.45 114.3,43.18 113.03,41.91 100.33,41.91 IC1.8 97.79,46.99 96.52,48.26 88.9,48.26 87.63,49.53 | IC1.13 87.63,49.53 | 87.63,49.53 86.36,48.26 69.85,48.26 67.31,45.72 | C7.2 81.92,10.79 IC4.5 IC4.6 IC4.7 IC4.8 86.36,6.2 86.36,5.08 | IC4.9 102.23,6.99 102.87,6.35 DS18B20.1 | IC4.9 88.27,6.99 86.36,5.08 | 86.36,5.08 JP1.1 | IC4.9 IC4.10 IC4.11 IC4.12 IC4.13 | IC9.12 17.78,64.77 19.05,63.5 40.64,63.5 41.91,64.77 | IC6.12 41.91,64.77 | 41.91,64.77 43.18,63.5 52.07,63.5 64.77,63.5 66.04,64.77 | 66.04,64.77 IC7.12 | IC10.12 90.17,64.77 | 90.17,64.77 88.9,63.5 67.31,63.5 66.04,64.77 | IC11.12 114.3,64.77 | 114.3,64.77 113.03,63.5 91.44,63.5 90.17,64.77 | IC8.12 138.43,64.77 137.16,63.5 115.57,63.5 114.3,64.77 | LED2.K 50.8,92.71 55.88,97.79 95.25,97.79 100.33,92.71 LED1.K
  Top 0.813: IC2.8 146.05,41.91 147.32,40.64 147.32,38.38 S6.2 143.51,34.57 | 143.51,30.48 146.33,27.66 S5.2 145.77,27.66 143.51,25.4 143.51,19.05 | 143.51,30.48 143.51,34.57 | S6.1 143.51,34.57 | S5.1 140.69,27.66 143.51,30.48 | 143.51,19.05 141.81,19.05 S4.1 136.17,17.5 132.08,21.59 C9.2 IC5.22 | 143.51,19.05 145.21,19.05 S4.2
  Bottom 0.305: C7.2 C3.1 | C4.1 C9.2 | JP4.6 132.72,1.91 136.53,1.91 138.11,3.49 138.11,15.56 140.02,17.46 S4.1
  Bottom 0.61: IC2.13 135.89,54.61 137.16,55.88 147.32,55.88 148.59,57.15 148.59,62.23 147.32,63.5 139.7,63.5 138.43,64.77 IC8.12
  Bottom 0.813: J1.GND 18.21,7.7 J1.GNDBREAK | J1.GNDBREAK 28.67,10.7 NIXIE_PWR_SUPPLY.GND 31.75,12.7 34.29,15.24 37.85,15.24 HVOUT.1 VIN.2 72.14,15.49 72.39,15.24 | 72.39,15.24 77.47,10.16 C7.2 | NIXIE_PWR_SUPPLY.GND2 72.39,33.02 76.2,29.21 BATTERY.- 81.28,24.13 72.39,15.24 | IC3.GND 11.43,27.94 | 11.43,27.94 C1.2 | C5.2 C6.2 | C6.2 C2.2 11.43,27.94 | J1.GNDBREAK 21.21,15.62 C6.2
  pour Bottom (isolate 1.27): 0,99.06 149.86,99.06 149.86,0 0,0
  pour Top (isolate 1.27): 0,99.06 149.86,99.06 149.86,0 0,0
MISO
  Top 0.305: IC5.18 128.91,11.43 130.18,12.7 131.44,12.7 135.89,8.26 JP4.1
MOSI
  Top 0.305: IC5.17 129.86,2.22 131.76,2.22 JP4.4
N$1
  Bottom 0.813: TUBE-1.A 15.24,72.39 25.4,72.39 25.4,86.36 17.78,93.98 R1.P$1
N$2
  Bottom 0.813: TUBE-2.A 36.83,72.39 46.99,72.39 46.99,86.36 R7.P$1
N$3
  Bottom 0.813: TUBE-3.A 64.77,72.39 74.93,72.39 74.93,86.36 67.31,93.98 R3.P$1
N$4
  Bottom 0.813: TUBE-4.A 86.36,72.39 96.52,72.39 96.52,85.09 R2.P$1
N$5
  Bottom 0.813: TUBE-5.A 114.3,72.39 125.73,72.39 125.73,86.36 121.92,90.17 116.84,90.17 R6.P$1
N$6
  Bottom 0.813: TUBE-6.A 135.89,72.39 146.05,72.39 146.05,87.63 143.51,87.63 R5.P$1
N$7
  Bottom 0.305: IC9.16 7.62,80.33 9.21,81.92 10.48,81.92 11.11,81.28 11.11,78.74 10.79,78.42 TUBE-1.1
N$8
  Bottom 0.406: IC9.15 10.16,76.52 9.21,77.47 9.21,80.01 9.53,80.33 TUBE-1.2
N$9  (via drill 0.51)
  Top 0.406: IC9.8 24.13,60.96 24.13,61.28 22.86,62.55 11.11,62.55 v8.57,65.09
  Bottom 0.406: v8.57,65.09 6.98,65.09 6.03,66.04 6.03,80.01 9.21,83.19 9.84,83.19 TUBE-1.3
N$10
  Bottom 0.406: IC9.9 24.13,66.04 24.13,65.72 22.23,63.82 6.98,63.82 5.08,65.72 5.08,80.33 10.16,85.41 11.43,85.41 TUBE-1.4
N$11
  Top 0.406: IC9.13 15.24,69.53 8.26,76.52 8.26,84.14 11.11,87 13.33,87 13.65,86.68 TUBE-1.5
N$12
  Top 0.406: IC9.14 12.7,70.8 7.3,76.2 7.3,84.45 11.11,88.27 14.92,88.27 16.51,86.68 TUBE-1.6
N$13
  Top 0.406: IC9.11 21.59,66.04 21.59,65.72 22.23,65.09 26.04,65.09 26.99,66.04 26.99,78.74 20.32,85.41 19.05,85.41 TUBE-1.7
N$14
  Top 0.406: IC9.10 22.86,80.96 20.64,83.19 TUBE-1.8
N$15  (via drill 0.51)
  Top 0.406: IC9.1 7.62,63.18 5.08,65.72 5.08,81.92 v5.4,82.23
  Bottom 0.406: v5.4,82.23 11.43,88.27 18.1,88.27 21.91,84.45 21.91,81.6 20.95,80.64 TUBE-1.9
N$16  (via drill 0.51)
  Top 0.406: IC9.2 10.16,61.91 6.03,66.04 6.03,68.58 7.94,70.48 v11.43,70.48 | v13.65,72.71 16.19,72.71 19.69,76.2 19.69,78.11 TUBE-1.0
  Bottom 0.406: v13.65,72.71 v11.43,70.48
N$17
  Top 0.406: IC6.16 31.75,77.79 32.07,78.11 TUBE-2.1
N$18
  Bottom 0.406: IC6.15 34.29,73.98 30.8,77.47 30.8,80.01 31.12,80.33 TUBE-2.2
N$19  (via drill 0.51)
  Top 0.406: v41.91,93.66 37.47,89.22 34.61,89.22 31.75,86.36 31.75,83.5 TUBE-2.3
  Bottom 0.406: IC6.8 49.53,63.18 52.39,66.04 52.39,83.19 v41.91,93.66
N$20  (via drill 0.51)
  Top 0.406: v49.53,75.56 IC6.9 | v48.58,81.28 47.31,81.28 40.32,88.27 34.93,88.27 33.34,86.68 33.34,85.72 TUBE-2.4
  Bottom 0.406: v49.53,75.56 49.53,79.38 48.58,80.33 v48.58,81.28
N$21  (via drill 0.51)
  Top 0.406: IC6.13 38.1,68.58 38.1,68.9 33.34,73.66 v33.02,73.66
  Bottom 0.406: v33.02,73.66 29.84,76.83 29.84,84.14 32.7,87 34.93,87 35.24,86.68 TUBE-2.5
N$22
  Bottom 0.406: IC6.14 35.56,66.04 35.56,65.72 34.93,65.09 31.12,65.09 28.26,67.94 28.26,83.82 32.7,88.27 36.51,88.27 38.1,86.68 TUBE-2.6
N$23
  Top 0.406: IC6.11 45.72,66.04 45.72,65.72 46.36,65.09 50.17,65.09 51.12,66.04 51.12,75.56 43.5,83.19 43.5,83.82 41.91,85.41 40.64,85.41 TUBE-2.7
N$24
  Top 0.406: IC6.10 46.99,78.42 42.23,83.19 TUBE-2.8
N$25
  Bottom 0.406: IC6.1 31.75,63.18 27.3,67.63 27.3,84.14 32.38,89.22 38.73,89.22 43.5,84.45 43.5,81.6 42.55,80.64 TUBE-2.9
N$26  (via drill 0.51)
  Top 0.406: v45.72,70.8 45.72,73.98 41.59,78.11 TUBE-2.0
  Bottom 0.406: IC6.2 35.56,60.96 35.56,61.28 39.37,65.09 50.17,65.09 51.12,66.04 51.12,68.58 48.9,70.8 v45.72,70.8
N$27
  Top 0.406: IC7.16 55.88,73.98 60.01,78.11 TUBE-3.1
N$28
  Bottom 0.406: IC7.15 58.42,79.69 59.06,80.33 TUBE-3.2
N$29  (via drill 0.51)
  Top 0.406: v76.52,81.28 68.58,89.22 62.55,89.22 59.69,86.36 59.69,83.5 TUBE-3.3
  Bottom 0.406: IC7.8 73.66,63.18 76.52,66.04 v76.52,81.28
N$30
  Top 0.406: IC7.9 76.52,70.17 76.52,79.69 72.39,83.82 72.39,84.14 68.26,88.27 62.86,88.27 61.28,86.68 61.28,85.72 TUBE-3.4
N$31  (via drill 0.51)
  Top 0.406: IC7.13 62.23,68.58 62.23,68.9 57.47,73.66 v57.15,73.66
  Bottom 0.406: v57.15,73.66 57.15,83.5 60.64,87 62.86,87 63.18,86.68 TUBE-3.5
N$32  (via drill 0.51)
  Top 0.406: IC7.14 60.96,68.26 v57.15,72.07
  Bottom 0.406: v57.15,72.07 55.88,73.34 55.88,83.5 60.64,88.27 64.45,88.27 66.04,86.68 TUBE-3.6
N$33  (via drill 0.51)
  Top 0.406: v72.39,70.8 72.39,73.66 72.07,73.98 72.07,79.06 72.71,79.69 72.71,82.23 71.44,83.5 71.44,83.82 69.85,85.41 68.58,85.41 TUBE-3.7
  Bottom 0.406: IC7.11 69.85,68.58 69.85,68.9 71.75,70.8 v72.39,70.8
N$34
  Top 0.406: IC7.10 71.12,79.38 71.75,80.01 71.75,81.6 70.17,83.19 TUBE-3.8
N$35
  Bottom 0.406: IC7.1 55.88,64.45 54.29,66.04 54.29,83.19 60.33,89.22 66.67,89.22 71.44,84.45 71.44,81.6 70.48,80.64 TUBE-3.9
N$36  (via drill 0.51)
  Top 0.406: v75.25,70.8 75.25,72.39 v73.34,74.3
  Bottom 0.406: IC7.2 59.69,60.96 59.69,61.28 63.5,65.09 74.3,65.09 75.25,66.04 v75.25,70.8 | v73.34,74.3 69.53,78.11 TUBE-3.0
N$37
  Top 0.406: IC10.16 80.01,76.52 81.6,78.11 TUBE-4.1
N$38
  Top 0.406: IC10.15 81.28,66.04 81.28,65.72 80.64,65.09 79.38,65.09 78.42,66.04 78.42,78.11 80.64,80.33 TUBE-4.2
N$39  (via drill 0.51)
  Top 0.406: v99.38,65.72 99.38,79.06 92.39,86.04 92.39,86.36 89.53,89.22 84.14,89.22 81.28,86.36 81.28,83.5 TUBE-4.3
  Bottom 0.406: IC10.8 97.79,64.14 v99.38,65.72
N$40
  Top 0.406: IC10.9 97.79,79.06 91.44,85.41 91.44,86.04 89.22,88.27 84.45,88.27 82.87,86.68 82.87,85.72 TUBE-4.4
N$41  (via drill 0.51)
  Top 0.406: IC10.13 87.63,70.17 v81.6,76.2
  Bottom 0.406: v81.6,76.2 79.38,78.42 79.38,84.14 82.23,87 84.45,87 84.77,86.68 TUBE-4.5
N$42  (via drill 0.51)
  Top 0.406: IC10.14 85.09,71.12 v81.6,74.61
  Bottom 0.406: v81.6,74.61 78.42,77.79 78.42,84.45 82.23,88.27 86.04,88.27 87.63,86.68 TUBE-4.6
N$43  (via drill 0.51)
  Top 0.406: IC10.11 92.71,70.17 93.34,70.8 v93.34,76.83
  Bottom 0.406: v93.34,76.83 93.34,83.5 91.44,85.41 90.17,85.41 TUBE-4.7
N$44
  Top 0.406: IC10.10 95.25,79.69 91.76,83.19 TUBE-4.8
N$45  (via drill 0.51)
  Top 0.406: v91.76,70.8 91.76,76.83 92.39,77.47 92.39,80.01 92.08,80.33 TUBE-4.9
  Bottom 0.406: IC10.1 80.01,64.45 78.42,66.04 78.42,68.58 79.38,69.53 90.49,69.53 v91.76,70.8
N$46  (via drill 0.51)
  Top 0.406: v90.17,70.8 90.17,75.56 90.81,76.2 90.81,78.11 TUBE-4.0
  Bottom 0.406: IC10.2 81.28,58.42 81.28,58.1 80.64,57.47 79.38,57.47 77.47,59.37 77.47,68.9 79.38,70.8 v90.17,70.8
N$47
  Top 0.406: IC11.16 104.14,72.71 109.54,78.11 TUBE-5.1
N$48
  Bottom 0.406: IC11.15 106.68,78.42 108.59,80.33 TUBE-5.2
N$49  (via drill 0.51)
  Top 0.406: v124.78,65.72 124.78,82.55 118.11,89.22 112.08,89.22 109.22,86.36 109.22,83.5 TUBE-5.3
  Bottom 0.406: IC11.8 121.92,62.87 v124.78,65.72
N$50
  Top 0.406: IC11.9 121.92,76.52 123.19,77.79 123.19,82.87 117.79,88.27 112.39,88.27 110.81,86.68 110.81,85.72 TUBE-5.4
N$51  (via drill 0.51)
  Top 0.406: IC11.13 110.49,68.58 110.49,68.9 107,72.39 v105.41,72.39
  Bottom 0.406: v105.41,72.39 105.41,82.23 110.17,87 112.39,87 112.71,86.68 TUBE-5.5
N$52  (via drill 0.51)
  Top 0.406: IC11.14 107.95,68.58 107.95,68.9 106.05,70.8 v105.41,70.8
  Bottom 0.406: v105.41,70.8 104.14,72.07 104.14,82.23 110.17,88.27 113.98,88.27 115.57,86.68 TUBE-5.6
N$53  (via drill 0.51)
  Top 0.406: v120.65,70.8 120.65,76.52 122.24,78.11 122.24,82.55 119.38,85.41 118.11,85.41 TUBE-5.7
  Bottom 0.406: IC11.11 118.11,68.58 118.11,68.9 120.02,70.8 v120.65,70.8
N$54
  Top 0.406: IC11.10 119.38,76.52 121.28,78.42 121.28,81.6 119.7,83.19 TUBE-5.8
N$55
  Bottom 0.406: IC11.1 104.14,64.45 102.55,66.04 102.55,81.92 109.86,89.22 115.89,89.22 118.11,87 118.43,87 120.97,84.45 120.97,81.6 120.02,80.64 TUBE-5.9
N$56  (via drill 0.51)
  Top 0.406: v122.24,64.77 123.51,66.04 v123.51,73.98
  Bottom 0.406: IC11.2 106.68,60.96 110.49,64.77 v122.24,64.77 | v123.51,73.98 119.06,78.42 TUBE-5.0
N$57
  Top 0.406: IC8.16 128.27,75.25 131.13,78.11 TUBE-6.1
N$58
  Bottom 0.406: IC8.15 130.81,76.52 129.86,77.47 129.86,80.01 130.18,80.33 TUBE-6.2
N$59
  Top 0.406: IC8.8 146.05,63.18 148.59,65.72 148.59,86.36 144.46,90.49 134.94,90.49 130.81,86.36 130.81,83.5 TUBE-6.3
N$60  (via drill 0.51)
  Top 0.406: v144.15,89.22 134.94,89.22 132.4,86.68 132.4,85.72 TUBE-6.4
  Bottom 0.406: IC8.9 146.05,70.48 147.32,71.75 147.32,88.27 146.37,89.22 v144.15,89.22
N$61  (via drill 0.51)
  Top 0.406: IC8.13 135.89,68.58 v129.54,74.93
  Bottom 0.406: v129.54,74.93 129.54,76.52 128.91,77.15 128.91,84.14 131.76,87 133.99,87 134.3,86.68 TUBE-6.5
N$62
  Bottom 0.406: IC8.14 132.08,66.04 132.08,65.72 131.44,65.09 127.63,65.09 126.68,66.04 126.68,71.44 127.32,72.07 127.32,83.82 131.76,88.27 135.57,88.27 137.16,86.68 TUBE-6.6
N$63  (via drill 0.51)
  Top 0.406: v144.78,70.8 144.78,80.96 142.56,83.19 142.56,83.82 140.97,85.41 139.7,85.41 TUBE-6.7
  Bottom 0.406: IC8.11 142.24,68.58 142.24,68.9 144.15,70.8 v144.78,70.8
N$64
  Top 0.406: IC8.10 143.51,80.96 141.29,83.19 TUBE-6.8
N$65  (via drill 0.51)
  Top 0.406: v126.37,64.77 126.37,83.5 v132.72,89.85
  Bottom 0.406: IC8.1 128.27,62.87 v126.37,64.77 | v132.72,89.85 137.16,89.85 142.56,84.45 142.56,81.6 141.6,80.64 TUBE-6.9
N$66  (via drill 0.51)
  Top 0.406: IC8.2 132.08,60.96 132.08,61.28 133.35,62.55 143.83,62.55 146.37,65.09 146.69,65.09 147.64,66.04 147.64,79.69 v144.46,82.87
  Bottom 0.406: v144.46,82.87 144.46,81.6 141.29,78.42 140.65,78.42 TUBE-6.0
N$67
  Bottom 0.305: IC1.1 80.01,48.26 IC7.6
N$68
  Bottom 0.305: IC1.2 82.55,46.67 71.12,58.1 IC7.7
N$69  (via drill 0.51)
  Top 0.305: v76.2,46.35 83.19,46.35 IC1.3
  Bottom 0.305: IC7.4 63.5,59.05 v76.2,46.35
N$70
  Bottom 0.305: IC7.3 63.18,61.91 71.44,61.91 72.39,60.96 72.39,58.42 76.52,54.29 80.64,54.29 82.55,52.39 IC1.15
N$71
  Bottom 0.305: IC12.1 31.75,48.26 IC9.6
N$72
  Bottom 0.305: IC12.2 34.29,46.67 22.86,58.1 IC9.7
N$73
  Bottom 0.305: IC9.4 15.24,58.42 31.12,42.55 34.93,42.55 IC12.3
N$74
  Bottom 0.305: IC9.3 14.92,61.91 25.72,61.91 34.29,53.34 IC12.15
N$75
  Bottom 0.305: IC2.1 128.27,48.26 IC11.6
N$76
  Bottom 0.305: IC2.2 130.81,46.67 119.38,58.1 IC11.7
N$77  (via drill 0.51)
  Top 0.305: v111.76,56.2 IC11.4 | v124.46,46.35 131.44,46.35 IC2.3
  Bottom 0.305: v111.76,56.2 114.62,56.2 v124.46,46.35
N$78
  Bottom 0.305: IC11.3 111.44,57.47 114.94,57.47 127,45.4 127,43.18 127.63,42.55 131.44,42.55 132.08,43.18 132.08,50.8 IC2.15
N$79
  Bottom 0.305: IC12.4 39.37,49.53 38.1,50.8 38.1,58.42 IC6.3
N$80
  Bottom 0.305: IC12.5 41.91,49.53 43.18,50.8 43.18,58.1 44.45,59.37 IC6.6
N$81
  Bottom 0.305: IC12.6 50.8,50.8 50.8,55.88 IC6.7
N$82
  Bottom 0.305: IC12.7 45.09,42.55 41.27,42.55 40.64,43.18 40.64,58.1 39.37,59.37 IC6.4
N$83  (via drill 0.51)
  Top 0.305: v63.18,52.07 IC12.9 | v68.58,52.39 76.84,52.39 79.38,49.85 82.87,49.85 IC1.14
  Bottom 0.305: v63.18,52.07 63.82,52.07 64.14,52.39 v68.58,52.39
N$84  (via drill 0.51)
  Top 0.305: IC1.9 111.12,52.07 v112.08,53.02
  Bottom 0.305: v112.08,53.02 112.08,54.29 107.95,58.42 107.95,60.96 108.9,61.91 119.7,61.91 120.65,60.96 120.65,58.42 124.78,54.29 131.13,54.29 IC2.14
N$85
  Bottom 0.305: IC1.4 87.63,49.53 86.36,50.8 86.36,58.42 IC10.3
N$86
  Bottom 0.305: IC1.5 90.17,49.53 91.44,50.8 91.44,58.1 92.71,59.37 IC10.6
N$87
  Bottom 0.305: IC1.6 99.06,50.8 99.06,54.93 95.25,58.74 IC10.7
N$88
  Bottom 0.305: IC1.7 95.25,46.04 99.7,50.48 99.7,55.24 96.52,58.42 96.52,60.96 95.57,61.91 89.53,61.91 87.63,60.01 IC10.4
N$89  (via drill 0.51)
  Top 0.305: LED2.A 52.07,80.01 62.23,90.17 90.81,90.17 99.7,81.28 104.78,81.28 v107.95,78.11
  Bottom 0.305: v107.95,78.11 107.95,63.5 105.41,60.96 105.41,57.78 111.76,51.44 111.76,50.16 111.12,49.53 105.41,49.53 R4.2
N$90
  Bottom 0.305: IC8.3 133.35,54.61 134.62,53.34 134.62,45.72 IC2.4
N$91  (via drill 0.51)
  Top 0.305: v145.1,54.61 145.1,55.56 IC8.6
  Bottom 0.305: IC2.5 138.43,49.53 139.7,50.8 139.7,53.34 140.97,54.61 v145.1,54.61
N$92  (via drill 0.51)
  Top 0.305: v147.32,54.29 143.51,58.1 IC8.7
  Bottom 0.305: IC2.6 147.32,50.8 v147.32,54.29
N$93  (via drill 0.51)
  Top 0.305: v148.91,54.29 v146.05,57.15
  Bottom 0.305: IC8.4 136.84,58.74 136.84,58.42 138.11,57.15 v146.05,57.15 | v148.91,54.29 148.91,49.85 IC2.7
N$102
  Top 0.406: BATTERY.+ 92.71,29.21 90.17,26.67 90.17,13.97 90.81,13.34 IC4.14
N$103  (via drill 0.51)
  Top 0.305: v100.97,64.77 100.97,79.38 LED1.A
  Bottom 0.305: R10.2 100.97,60.33 v100.97,64.77
RESET  (via drill 0.51)
  Top 0.305: v120.65,36.83 IC5.1
  Top 0.813: JP4.5 R11.2
  Bottom 0.305: v120.65,36.83 121.92,35.56 124.46,35.56 130.81,29.21 R11.2
SCK
  Bottom 0.305: IC5.19 125.73,13.97 JP4.3
SCL  (via drill 0.51)
  Top 0.305: IC5.28 116.84,30.48 114.3,30.48 101.6,17.78
  Top 0.61: IC4.16 v96.84,15.88 98.42,15.88 100.33,17.78 101.6,17.78 R13.1
  Bottom 0.305: JP1.4 93.98,13.02 v96.84,15.88
SDA
  Top 0.305: IC5.27 116.84,27.94 114.3,27.94 104.14,17.78 104.14,15.24 R12.1
  Top 0.61: IC4.15 98.42,14.61 99.06,13.97 R12.1
  Bottom 0.305: JP1.3 91.44,12.06 96.52,17.14 99.7,17.14 R12.1
V+
  Bottom 0.61: 122.4,93.5 122.87,93.98 R6.P$2
  Bottom 0.813: R5.P$2 R6.P$2 | 123.19,92.71 122.4,93.5 119.38,96.52 85.09,96.52 82.55,93.98 R2.P$2 R3.P$2 73.66,95.25 72.39,96.52 31.75,96.52 R7.P$2 R1.P$2 21.59,96.52 11.43,96.52 8.89,93.98 8.89,91.44 3.81,86.36 3.81,57.15 6.35,54.61 13.97,54.61 21.59,46.99 21.59,34.29 24.13,31.75 31.75,31.75 | HVOUT.2 38.1,21.59 31.75,27.94 31.75,31.75 | NIXIE_PWR_SUPPLY.HV+ 31.75,31.75
VCC
  Top 0.61: IC4.2 81.92,14.61 C7.1 | R13.2 R12.2 R8.2 DS18B20.3 107.95,2.54 106.68,1.27 90.17,1.27 88.9,2.54 JP1.2
  Top 0.813: IC3.OUT 13.97,39.37 26.67,52.07 IC12.16 | IC12.16 21.59,52.07 17.78,55.88 IC9.5 | IC6.5 41.91,57.15 | 41.91,57.15 40.64,55.88 33.02,55.88 31.75,54.61 IC12.16 | IC12.10 46.99,54.61 | 46.99,54.61 45.72,55.88 43.18,55.88 41.91,57.15 | C8.1 64.77,54.61 | 64.77,54.61 66.04,55.88 | 66.04,55.88 IC7.5 | 64.77,54.61 55.88,54.61 54.61,55.88 48.26,55.88 46.99,54.61 | 66.04,55.88 76.2,55.88 IC1.16 80.01,54.61 81.28,55.88 88.9,55.88 90.17,57.15 | IC10.5 90.17,57.15 | 90.17,57.15 91.44,55.88 93.98,55.88 95.25,54.61 | 95.25,54.61 IC1.10 | 95.25,54.61 113.03,54.61 114.3,55.88 | 114.3,55.88 IC11.5 114.3,60.96 | 114.3,55.88 115.57,54.61 C10.1 116.84,52.07 IC2.16 128.27,54.61 129.54,55.88 137.16,55.88 138.43,57.15 | IC8.5 138.43,57.15 | 138.43,57.15 139.7,55.88 142.24,55.88 143.51,54.61 IC2.10 | IC5.20 C9.1 133.35,16.51 135.89,13.97 R11.1 137.16,10.16 138.43,10.16 139.7,8.89 139.7,5.08 138.43,3.81 JP4.2
  Bottom 0.61: C7.1 C3.2 81.28,13.34 82.23,13.34 88.9,6.67 JP1.2 | C9.1 C4.2 | IC5.20 121.28,16.51 117.95,19.84 | 117.95,19.84 116.21,21.59 IC5.7 114.94,21.59 111.12,17.78 R13.2 | C10.1 115.57,48.26 118.11,45.72 118.11,20 117.95,19.84
  Bottom 0.813: IC3.OUT 16.51,31.75 C2.1 19.05,25.4 C6.1
VIN
  Top 0.305: 66.04,18.1 VIN.1 66.04,17.78
  Top 0.813: 66.04,17.78 69.85,17.78 72.39,15.24 NIXIE_PWR_SUPPLY.V+ 69.85,5.08 34.29,5.08 34.29,8.89 29.48,13.7 J1.PWR
  Bottom 0.813: IC3.IN 6.35,31.75 C1.1 3.81,25.4 C5.1 12.97,13.7 J1.PWR

### Text on the board
tPlace: + | +
tNames: 74141 | 74141 | 74141 | 74141 | 74141 | 74141 | 74HC595 | 74HC595 | 1k5 | 1k5 | 74HC595 | 100n | 100n | 7805 | Minutes | Nixie power supply | +200V | GND | 10uF | 10uF | Hours | CR2032 / Backup / Battery | +3V | + | + | (BOBRICIUS) | 100n | 100n | +200V | +12V | 4k7 | ATMEGA328 | Mode | +12V | GND | GND | 100n | 4k7 | 10k | 4k7 | GND | DS18B20 | GND | GND | +12V | 100n | RTC module
bNames: SDA | SCL | GND | +5V | +5V | GND